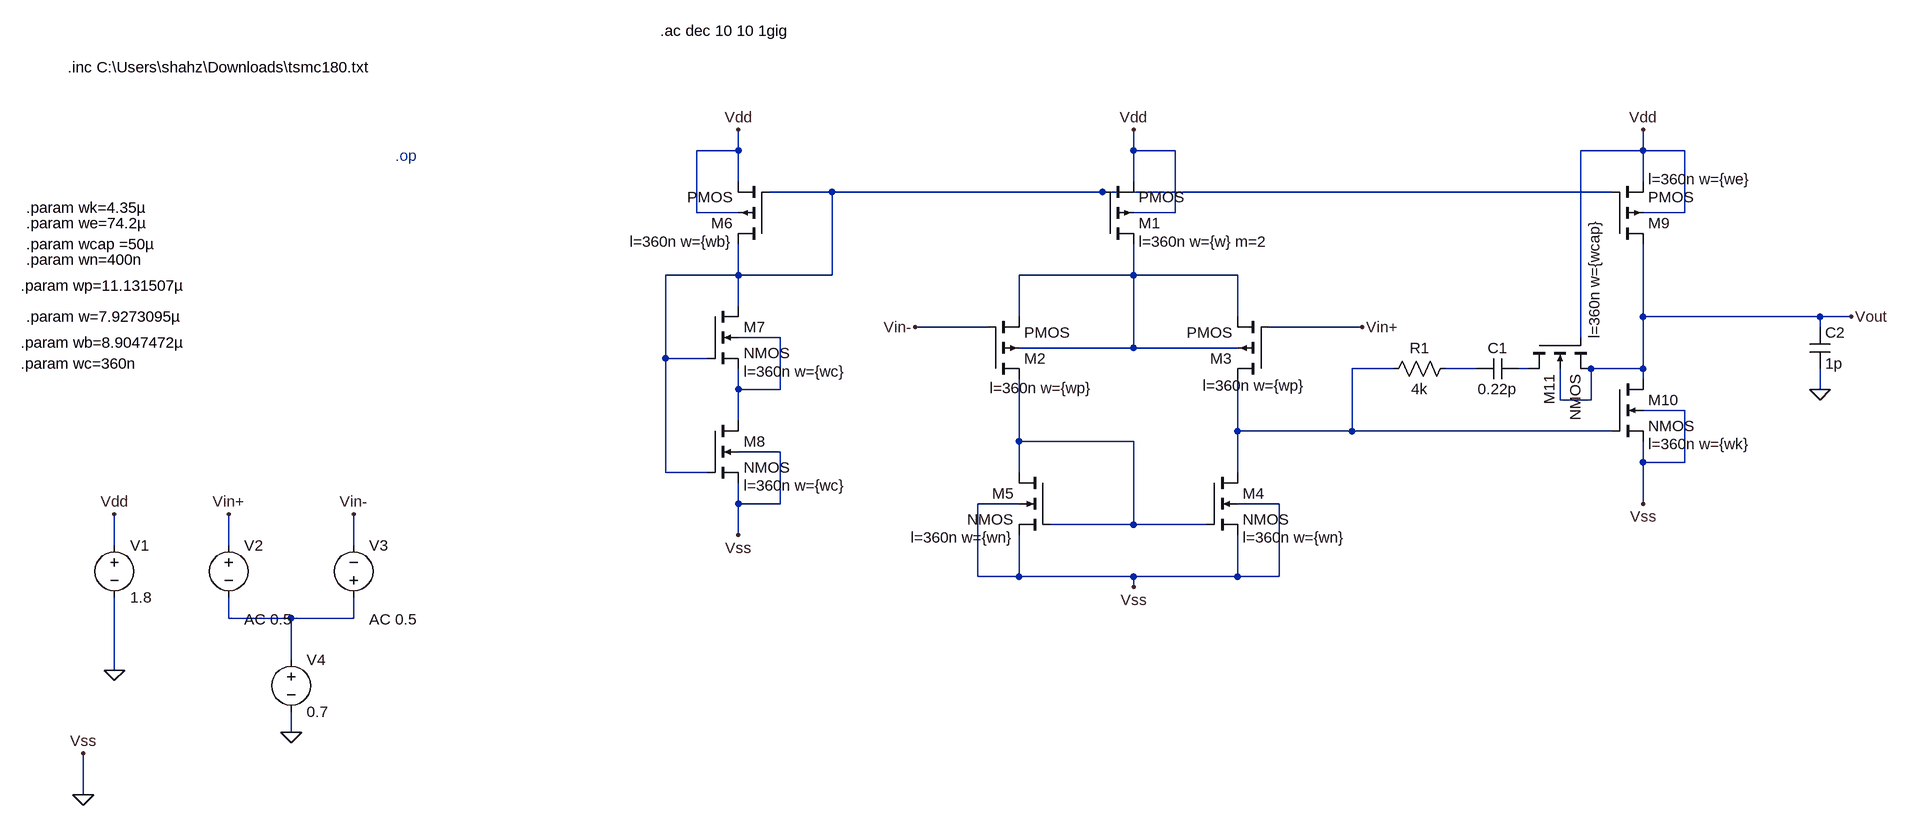
[diagram p0: schematic Error___AMP.asc]
Error___AMP.asc, the LTspice schematic file:
Version 4
SHEET 1 1364 840
WIRE -432 -176 -432 -208
WIRE -432 -176 -496 -176
WIRE 176 -176 176 -208
WIRE 240 -176 176 -176
WIRE 960 -176 960 -208
WIRE 960 -176 864 -176
WIRE 1024 -176 960 -176
WIRE -432 -128 -432 -176
WIRE 176 -128 176 -176
WIRE 960 -128 960 -176
WIRE -288 -112 -384 -112
WIRE 128 -112 -288 -112
WIRE 912 -112 128 -112
WIRE -496 -80 -496 -176
WIRE -432 -80 -496 -80
WIRE 240 -80 240 -176
WIRE 240 -80 176 -80
WIRE 1024 -80 1024 -176
WIRE 1024 -80 960 -80
WIRE -432 16 -432 -32
WIRE -432 16 -544 16
WIRE -288 16 -288 -112
WIRE -288 16 -432 16
WIRE 176 16 176 -32
WIRE 176 16 0 16
WIRE 336 16 176 16
WIRE -432 64 -432 16
WIRE 0 80 0 16
WIRE 336 80 336 16
WIRE 960 80 960 -32
WIRE 1232 80 960 80
WIRE 1280 80 1232 80
WIRE -48 96 -160 96
WIRE 528 96 384 96
WIRE 1232 96 1232 80
WIRE -368 112 -432 112
WIRE 864 112 864 -176
WIRE 176 128 176 16
WIRE 176 128 0 128
WIRE 336 128 176 128
WIRE -544 144 -544 16
WIRE -480 144 -544 144
WIRE 576 160 512 160
WIRE 704 160 656 160
WIRE 784 160 768 160
WIRE 880 160 864 160
WIRE 960 160 960 80
WIRE 960 160 880 160
WIRE 960 176 960 160
WIRE -432 192 -432 160
WIRE -368 192 -368 112
WIRE -368 192 -432 192
WIRE 1232 192 1232 160
WIRE 832 208 832 160
WIRE 880 208 880 160
WIRE 880 208 832 208
WIRE 1024 224 960 224
WIRE -432 240 -432 192
WIRE 336 256 336 176
WIRE 512 256 512 160
WIRE 512 256 336 256
WIRE 912 256 512 256
WIRE 0 272 0 176
WIRE 176 272 0 272
WIRE -368 288 -432 288
WIRE 960 304 960 272
WIRE 1024 304 1024 224
WIRE 1024 304 960 304
WIRE -544 320 -544 144
WIRE -480 320 -544 320
WIRE 0 320 0 272
WIRE 336 320 336 256
WIRE -432 368 -432 336
WIRE -368 368 -368 288
WIRE -368 368 -432 368
WIRE 0 368 -64 368
WIRE 400 368 336 368
WIRE 960 368 960 304
WIRE 176 400 176 272
WIRE 176 400 48 400
WIRE 288 400 176 400
WIRE -432 416 -432 368
WIRE -1392 432 -1392 384
WIRE -1216 432 -1216 384
WIRE -1024 432 -1024 384
WIRE -64 480 -64 368
WIRE 0 480 0 416
WIRE 0 480 -64 480
WIRE 176 480 0 480
WIRE 336 480 336 416
WIRE 336 480 176 480
WIRE 400 480 400 368
WIRE 400 480 336 480
WIRE 176 496 176 480
WIRE -1216 544 -1216 512
WIRE -1120 544 -1216 544
WIRE -1024 544 -1024 512
WIRE -1024 544 -1120 544
WIRE -1120 608 -1120 544
WIRE -1392 624 -1392 512
WIRE -1120 720 -1120 688
WIRE -1440 816 -1440 752
FLAG -160 96 Vin-
FLAG 528 96 Vin+
FLAG 176 -208 Vdd
FLAG -432 -208 Vdd
FLAG 960 -208 Vdd
FLAG 1280 80 Vout
FLAG -432 416 Vss
FLAG 176 496 Vss
FLAG 960 368 Vss
FLAG -1392 624 0
FLAG -1120 720 0
FLAG -1216 384 Vin+
FLAG -1024 384 Vin-
FLAG -1392 384 Vdd
FLAG -1440 816 0
FLAG -1440 752 Vss
FLAG 1232 192 0
DATAFLAG 416 256 ""
DATAFLAG 128 16 ""
DATAFLAG -128 -112 ""
DATAFLAG 640 -112 ""
DATAFLAG 1056 80 ""
SYMBOL pmos4 128 -32 M180
WINDOW 123 56 4 Left 2
SYMATTR Value2 l=360n w={w} m=2
SYMATTR InstName M1
SYMBOL pmos4 -48 176 M180
WINDOW 123 3 -14 Left 2
SYMATTR Value2 l=360n w={wp}
SYMATTR InstName M2
SYMBOL pmos4 384 176 R180
WINDOW 123 -57 -10 Left 2
SYMATTR Value2 l=360n w={wp}
SYMATTR InstName M3
SYMBOL nmos4 288 320 R0
WINDOW 123 56 100 Left 2
SYMATTR Value2 l=360n w={wn}
SYMATTR InstName M4
SYMBOL nmos4 48 320 M0
WINDOW 123 56 100 Left 2
SYMATTR Value2 l=360n w={wn}
SYMATTR InstName M5
SYMBOL pmos4 -384 -32 R180
WINDOW 123 56 4 Left 2
SYMATTR Value2 l=360n w={wb}
SYMATTR InstName M6
SYMBOL nmos4 -480 64 R0
WINDOW 123 56 100 Left 2
SYMATTR Value2 l=360n w={wc}
SYMATTR InstName M7
SYMBOL nmos4 -480 240 R0
WINDOW 123 56 100 Left 2
SYMATTR Value2 l=360n w={wc}
SYMATTR InstName M8
SYMBOL pmos4 912 -32 M180
WINDOW 123 56 100 Left 2
SYMATTR Value2 l=360n w={we}
SYMATTR InstName M9
SYMBOL nmos4 912 176 R0
WINDOW 123 56 100 Left 2
SYMATTR Value2 l=360n w={wk}
SYMATTR InstName M10
SYMBOL cap 768 144 R90
WINDOW 0 0 32 VBottom 2
WINDOW 3 32 32 VTop 2
SYMATTR InstName C1
SYMATTR Value 0.22p
SYMBOL nmos4 784 112 M90
WINDOW 123 -182 101 Left 2
SYMATTR Value2 l=360n w={wcap}
SYMATTR InstName M11
SYMBOL res 672 144 R90
WINDOW 0 0 56 VBottom 2
WINDOW 3 32 56 VTop 2
SYMATTR InstName R1
SYMATTR Value 4k
SYMBOL voltage -1392 416 R0
WINDOW 123 0 0 Left 0
WINDOW 39 0 0 Left 0
SYMATTR InstName V1
SYMATTR Value 1.8
SYMBOL voltage -1216 416 R0
WINDOW 123 24 130 Left 2
WINDOW 39 0 0 Left 0
SYMATTR Value2 AC 0.5
SYMATTR InstName V2
SYMATTR Value ""
SYMBOL voltage -1024 528 M180
WINDOW 0 24 96 Left 2
WINDOW 3 24 16 Left 2
WINDOW 123 24 -18 Left 2
WINDOW 39 0 0 Left 0
SYMATTR InstName V3
SYMATTR Value ""
SYMATTR Value2 AC 0.5
SYMBOL voltage -1120 592 R0
WINDOW 123 0 0 Left 0
WINDOW 39 0 0 Left 0
SYMATTR InstName V4
SYMATTR Value 0.7
SYMBOL cap 1216 96 R0
SYMATTR InstName C2
SYMATTR Value 1p
TEXT -1528 -8 Left 2 !.param wn=400n
TEXT -1536 32 Left 2 !.param wp=11.131507µ
TEXT -1528 80 Left 2 !.param w=7.9273095µ
TEXT -1528 -64 Left 2 !.param we=74.2µ
TEXT -1528 -88 Left 2 !.param wk=4.35µ
TEXT -1536 120 Left 2 !.param wb=8.9047472µ
TEXT -1536 152 Left 2 !.param wc=360n
TEXT -1528 -32 Left 2 !.param wcap =50µ
TEXT -1464 -304 Left 2 !.inc C:\\Users\\shahz\\Downloads\\tsmc180.txt
TEXT -552 -360 Left 2 !.ac dec 10 10 1gig
TEXT -960 -168 Left 2 ;.op

The netlist it stands for:
* Error___AMP.asc
M1 N002 N001 Vdd Vdd PMOS l=360n w={w} m=2
M2 N007 Vin- N002 N002 PMOS l=360n w={wp}
M3 N004 Vin+ N002 N002 PMOS l=360n w={wp}
M4 N004 N007 0 0 NMOS l=360n w={wn}
M5 N007 N007 0 0 NMOS l=360n w={wn}
M6 N001 N001 Vdd Vdd PMOS l=360n w={wb}
M7 N001 N001 N003 N003 NMOS l=360n w={wc}
M8 N003 N001 0 0 NMOS l=360n w={wc}
M9 Vout N001 Vdd Vdd PMOS l=360n w={we}
M10 Vout N004 0 0 NMOS l=360n w={wk}
C1 N006 N005 0.22p
M11 N006 Vdd Vout Vout NMOS l=360n w={wcap}
R1 N005 N004 4k
V1 Vdd 0 1.8
V2 Vin+ N008 AC 0.5
V3 N008 Vin- AC 0.5
V4 N008 0 0.7
C2 Vout 0 1p
.model NMOS NMOS
.model PMOS PMOS
.lib standard.mos
.param wn=400n
.param wp=11.131507µ
.param w=7.9273095µ
.param we=74.2µ
.param wk=4.35µ
.param wb=8.9047472µ
.param wc=360n
.param wcap =50µ
.inc C:\Users\shahz\Downloads\tsmc180.txt
.ac dec 10 10 1gig
* .op
.backanno
.end